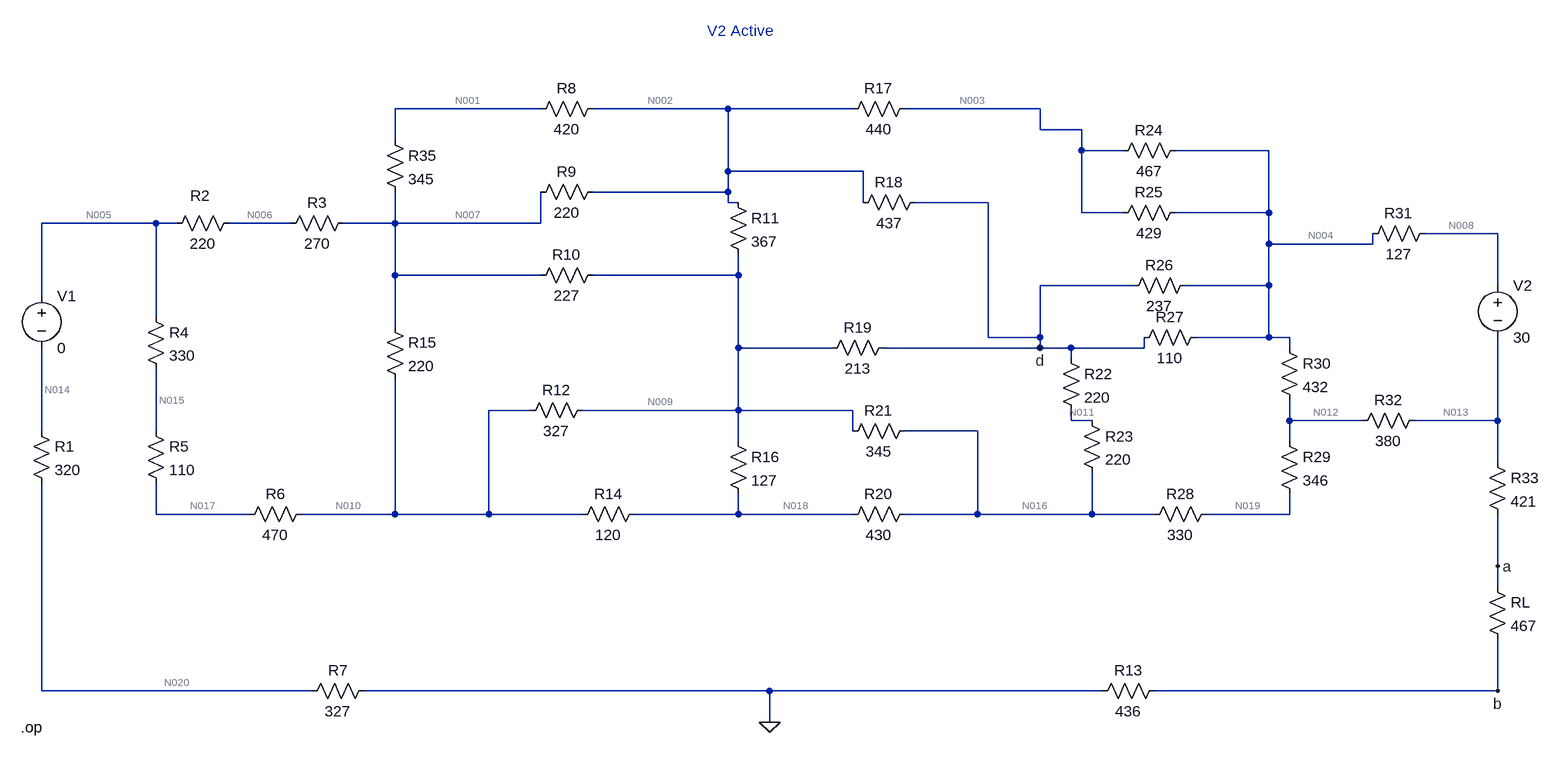
[diagram p0: schematic OELSim1102_00725205131037_g.asc]
OELSim1102_00725205131037_g.asc, the LTspice schematic file:
Version 4.1
SHEET 1 2212 824
WIRE 672 -144 448 -144
WIRE 960 -144 752 -144
WIRE 1152 -144 960 -144
WIRE 1440 -144 1232 -144
WIRE 1440 -112 1440 -144
WIRE 1504 -112 1440 -112
WIRE 448 -96 448 -144
WIRE 1504 -80 1504 -112
WIRE 1568 -80 1504 -80
WIRE 1792 -80 1648 -80
WIRE 960 -48 960 -144
WIRE 1168 -48 960 -48
WIRE 960 -16 960 -48
WIRE 960 -16 752 -16
WIRE 960 0 960 -16
WIRE 976 0 960 0
WIRE 1168 0 1168 -48
WIRE 1360 0 1248 0
WIRE 1504 16 1504 -80
WIRE 1568 16 1504 16
WIRE 1792 16 1792 -80
WIRE 1792 16 1648 16
WIRE 80 32 -96 32
WIRE 112 32 80 32
WIRE 288 32 192 32
WIRE 448 32 448 -16
WIRE 448 32 368 32
WIRE 672 32 672 -16
WIRE 672 32 448 32
WIRE 2144 48 2032 48
WIRE 1792 64 1792 16
WIRE 1952 64 1952 48
WIRE 1952 64 1792 64
WIRE 448 112 448 32
WIRE 672 112 448 112
WIRE 976 112 976 80
WIRE 976 112 752 112
WIRE 1584 128 1440 128
WIRE 1792 128 1792 64
WIRE 1792 128 1664 128
WIRE 2144 128 2144 48
WIRE -96 144 -96 32
WIRE 80 176 80 32
WIRE 448 192 448 112
WIRE 1360 208 1360 0
WIRE 1440 208 1440 128
WIRE 1440 208 1360 208
WIRE 1792 208 1792 128
WIRE 1792 208 1680 208
WIRE 1824 208 1792 208
WIRE 976 224 976 112
WIRE 1120 224 976 224
WIRE 1440 224 1440 208
WIRE 1440 224 1200 224
WIRE 1488 224 1440 224
WIRE 1600 224 1600 208
WIRE 1600 224 1488 224
WIRE 1824 224 1824 208
WIRE 1488 240 1488 224
WIRE 656 320 592 320
WIRE 976 320 976 224
WIRE 976 320 736 320
WIRE 1152 320 976 320
WIRE 1488 336 1488 320
WIRE 1520 336 1488 336
WIRE 1824 336 1824 304
WIRE 1936 336 1824 336
WIRE 2144 336 2144 208
WIRE 2144 336 2016 336
WIRE -96 352 -96 224
WIRE 80 352 80 256
WIRE 1152 352 1152 320
WIRE 1344 352 1232 352
WIRE 976 368 976 320
WIRE 1824 368 1824 336
WIRE 2144 400 2144 336
WIRE 80 480 80 432
WIRE 224 480 80 480
WIRE 448 480 448 272
WIRE 448 480 304 480
WIRE 592 480 592 320
WIRE 592 480 448 480
WIRE 736 480 592 480
WIRE 976 480 976 448
WIRE 976 480 816 480
WIRE 1152 480 976 480
WIRE 1344 480 1344 352
WIRE 1344 480 1232 480
WIRE 1520 480 1520 416
WIRE 1520 480 1344 480
WIRE 1616 480 1520 480
WIRE 1824 480 1824 448
WIRE 1824 480 1696 480
WIRE 2144 560 2144 480
WIRE 2144 592 2144 560
WIRE -96 752 -96 432
WIRE 320 752 -96 752
WIRE 1024 752 400 752
WIRE 1536 752 1024 752
WIRE 2144 752 2144 672
WIRE 2144 752 1616 752
WIRE 1024 800 1024 752
FLAG 1440 224 d
FLAG 2144 560 a
FLAG 2144 752 b
FLAG 1024 800 0
SYMBOL voltage -96 128 R0
WINDOW 123 0 0 Left 0
WINDOW 39 0 0 Left 0
SYMATTR InstName V1
SYMATTR Value 0
SYMBOL res -112 336 R0
SYMATTR InstName R1
SYMATTR Value 320
SYMBOL res 208 16 R90
WINDOW 0 -11 60 VBottom 2
WINDOW 3 32 56 VTop 2
SYMATTR InstName R2
SYMATTR Value 220
SYMBOL res 384 16 R90
WINDOW 0 0 56 VBottom 2
WINDOW 3 32 56 VTop 2
SYMATTR InstName R3
SYMATTR Value 270
SYMBOL res 64 160 R0
SYMATTR InstName R4
SYMATTR Value 330
SYMBOL res 64 336 R0
SYMATTR InstName R5
SYMATTR Value 110
SYMBOL res 320 464 R90
WINDOW 0 0 56 VBottom 2
WINDOW 3 32 56 VTop 2
SYMATTR InstName R6
SYMATTR Value 470
SYMBOL res 416 736 R90
WINDOW 0 0 56 VBottom 2
WINDOW 3 32 56 VTop 2
SYMATTR InstName R7
SYMATTR Value 327
SYMBOL res 432 176 R0
SYMATTR InstName R15
SYMATTR Value 220
SYMBOL res 768 -32 R90
WINDOW 0 0 56 VBottom 2
WINDOW 3 32 56 VTop 2
SYMATTR InstName R9
SYMATTR Value 220
SYMBOL res 768 96 R90
WINDOW 0 0 56 VBottom 2
WINDOW 3 32 56 VTop 2
SYMATTR InstName R10
SYMATTR Value 227
SYMBOL res 960 -16 R0
SYMATTR InstName R11
SYMATTR Value 367
SYMBOL res 752 304 R90
WINDOW 0 0 56 VBottom 2
WINDOW 3 32 56 VTop 2
SYMATTR InstName R12
SYMATTR Value 327
SYMBOL res 832 464 R90
WINDOW 0 0 56 VBottom 2
WINDOW 3 32 56 VTop 2
SYMATTR InstName R14
SYMATTR Value 120
SYMBOL res 960 352 R0
SYMATTR InstName R16
SYMATTR Value 127
SYMBOL res 1248 -160 R90
WINDOW 0 0 56 VBottom 2
WINDOW 3 32 56 VTop 2
SYMATTR InstName R17
SYMATTR Value 440
SYMBOL res 1264 -16 R90
WINDOW 0 0 56 VBottom 2
WINDOW 3 32 56 VTop 2
SYMATTR InstName R18
SYMATTR Value 437
SYMBOL res 1216 208 R90
WINDOW 0 0 56 VBottom 2
WINDOW 3 32 56 VTop 2
SYMATTR InstName R19
SYMATTR Value 213
SYMBOL res 1248 464 R90
WINDOW 0 0 56 VBottom 2
WINDOW 3 32 56 VTop 2
SYMATTR InstName R20
SYMATTR Value 430
SYMBOL res 1248 336 R90
WINDOW 0 0 56 VBottom 2
WINDOW 3 32 56 VTop 2
SYMATTR InstName R21
SYMATTR Value 345
SYMBOL res 1472 224 R0
SYMATTR InstName R22
SYMATTR Value 220
SYMBOL res 1504 320 R0
SYMATTR InstName R23
SYMATTR Value 220
SYMBOL res 1664 -96 R90
WINDOW 0 0 56 VBottom 2
WINDOW 3 32 56 VTop 2
SYMATTR InstName R24
SYMATTR Value 467
SYMBOL res 1664 0 R90
WINDOW 0 0 56 VBottom 2
WINDOW 3 32 56 VTop 2
SYMATTR InstName R25
SYMATTR Value 429
SYMBOL res 1680 112 R90
WINDOW 0 0 56 VBottom 2
WINDOW 3 32 56 VTop 2
SYMATTR InstName R26
SYMATTR Value 237
SYMBOL res 1696 192 R90
WINDOW 0 0 56 VBottom 2
WINDOW 3 32 56 VTop 2
SYMATTR InstName R27
SYMATTR Value 110
SYMBOL res 1712 464 R90
WINDOW 0 0 56 VBottom 2
WINDOW 3 32 56 VTop 2
SYMATTR InstName R28
SYMATTR Value 330
SYMBOL res 1808 352 R0
SYMATTR InstName R29
SYMATTR Value 346
SYMBOL res 1808 208 R0
SYMATTR InstName R30
SYMATTR Value 432
SYMBOL res 2048 32 R90
WINDOW 0 0 56 VBottom 2
WINDOW 3 32 56 VTop 2
SYMATTR InstName R31
SYMATTR Value 127
SYMBOL voltage 2144 112 R0
WINDOW 123 0 0 Left 0
WINDOW 39 0 0 Left 0
SYMATTR InstName V2
SYMATTR Value 30
SYMBOL res 2032 320 R90
WINDOW 0 0 56 VBottom 2
WINDOW 3 32 56 VTop 2
SYMATTR InstName R32
SYMATTR Value 380
SYMBOL res 2128 384 R0
SYMATTR InstName R33
SYMATTR Value 421
SYMBOL res 2128 576 R0
SYMATTR InstName RL
SYMATTR Value 467
SYMBOL res 432 -112 R0
SYMATTR InstName R35
SYMATTR Value 345
SYMBOL res 768 -160 R90
WINDOW 0 0 56 VBottom 2
WINDOW 3 32 56 VTop 2
SYMATTR InstName R8
SYMATTR Value 420
SYMBOL res 1632 736 R90
WINDOW 0 0 56 VBottom 2
WINDOW 3 32 56 VTop 2
SYMATTR InstName R13
SYMATTR Value 436
TEXT -128 808 Left 2 !.op
TEXT 928 -264 Left 2 ;V2 Active

The netlist it stands for:
* OELSim1102_00725205131037_g.asc
V1 N005 N014 0
R1 N014 N020 320
R2 N006 N005 220
R3 N007 N006 270
R4 N005 N015 330
R5 N015 N017 110
R6 N010 N017 470
R7 0 N020 327
R15 N007 N010 220
R9 N002 N007 220
R10 N009 N007 227
R11 N002 N009 367
R12 N009 N010 327
R14 N018 N010 120
R16 N009 N018 127
R17 N003 N002 440
R18 d N002 437
R19 d N009 213
R20 N016 N018 430
R21 N016 N009 345
R22 d N011 220
R23 N011 N016 220
R24 N004 N003 467
R25 N004 N003 429
R26 N004 d 237
R27 N004 d 110
R28 N019 N016 330
R29 N012 N019 346
R30 N004 N012 432
R31 N008 N004 127
V2 N008 N013 30
R32 N013 N012 380
R33 N013 a 421
RL a b 467
R35 N001 N007 345
R8 N002 N001 420
R13 b 0 436
.op
* V2 Active
.backanno
.end

* Results of the author's LTspice run, read from the files saved beside the schematic
* Operating Point:
*   V(a) = -8.322 V
*   V(b) = -4.018 V
*   V(d) = 10.91 V
*   V(n001) = 9.313 V
*   V(n002) = 9.773 V
*   V(n003) = 11.33 V
*   V(n004) = 12.12 V
*   V(n005) = 5.963 V
*   V(n006) = 7.297 V
*   V(n007) = 8.936 V
*   V(n008) = 17.8 V
*   V(n009) = 9.313 V
*   V(n010) = 8.827 V
*   V(n011) = 9.61 V
*   V(n012) = 1.282 V
*   V(n013) = -12.2 V
*   V(n014) = 5.963 V
*   V(n015) = 7.001 V
*   V(n016) = 8.305 V
*   V(n017) = 7.348 V
*   V(n018) = 8.968 V
*   V(n019) = 4.877 V
*   V(n020) = 3.014 V
*   I(R1) = 9.216 mA
*   I(R10) = 1.66 mA
*   I(R11) = 1.254 mA
*   I(R12) = 1.484 mA
*   I(R13) = -9.216 mA
*   I(R14) = 1.172 mA
*   I(R15) = 492.2 µA
*   I(R16) = 2.713 mA
*   I(R17) = 3.54 mA
*   I(R18) = 2.613 mA
*   I(R19) = 7.522 mA
*   I(R2) = 6.068 mA
*   I(R20) = -1.541 mA
*   I(R21) = -2.919 mA
*   I(R22) = 5.93 mA
*   I(R23) = 5.93 mA
*   I(R24) = 1.695 mA
*   I(R25) = 1.845 mA
*   I(R26) = 5.093 mA
*   I(R27) = 10.97 mA
*   I(R28) = -10.39 mA
*   I(R29) = -10.39 mA
*   I(R3) = 6.068 mA
*   I(R30) = 25.09 mA
*   I(R31) = 44.7 mA
*   I(R32) = -35.48 mA
*   I(R33) = -9.216 mA
*   I(R35) = 1.094 mA
*   I(R4) = -3.148 mA
*   I(R5) = -3.148 mA
*   I(R6) = 3.148 mA
*   I(R7) = -9.216 mA
*   I(R8) = 1.094 mA
*   I(R9) = 3.805 mA
*   I(RL) = -9.216 mA
*   I(V1) = 9.216 mA
*   I(V2) = -44.7 mA